# Altium schematic sheet AmpliRF.SchDoc
size A4
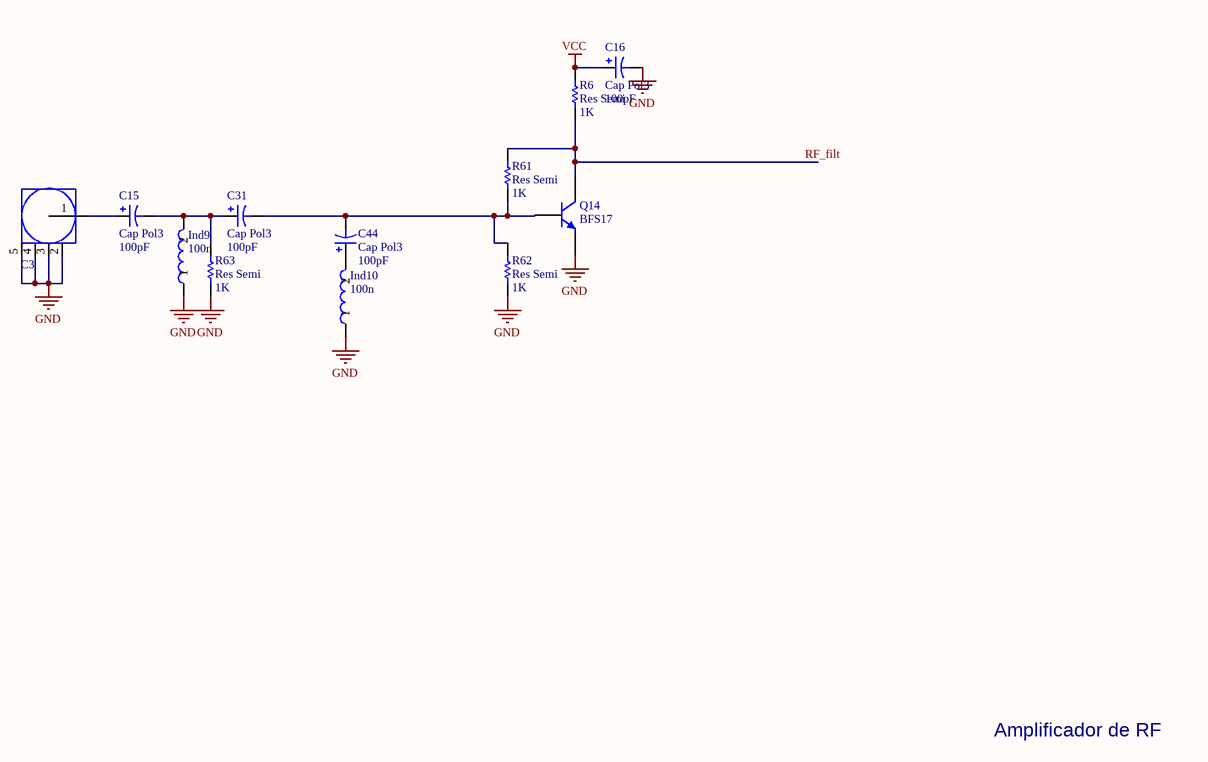
[diagram p0: AmpliRF.SchDoc]

## Parts
C3  SMA  [SMA1]  (value not drawn)
C15  Cap Pol3  value 100pF  [C0805]
C16  Cap Pol3  value 100pF  [C0805]
C31  Cap Pol3  value 100pF  [C0805]
C44  Cap Pol3  value 100pF  [C0805]
Ind9  Valor: 100n  [Ind_4mm]  (hidden comment: Ind2)
Ind10  Valor: 100n  [Ind_4mm]  (hidden comment: Ind2)
Q14  BFS17  [SOT-23]
R6  Res Semi  value 1K  [2012[0805]]
R61  Res Semi  value 1K  [2012[0805]]
R62  Res Semi  value 1K  [2012[0805]]
R63  Res Semi  value 1K  [2012[0805]]

## Nets
GND: C3.2(GND) C3.3(GND) C3.4(GND) C3.5(GND) C16.2 Ind9.1 Ind10.1 Q14.2(E) R62.2 R63.2
VCC: C16.1 R6.1
RF_filt: Q14.3(C) R6.2 R61.1
NetC3_1: C3.1(RF) C15.1
NetC15_2: C15.2 C31.1 Ind9.2 R63.1
NetC31_2: C31.2 C44.2 Q14.1(B) R61.2 R62.1
NetC44_1: C44.1 Ind10.2

## Notes on the sheet
- Amplificador de RF

## Library data of the parts
C15 C16 C31 C44 = Cap Pol3: Polarized Capacitor (Surface Mount); Published: 8-Jun-2000; LatestRevisionDate: 17-Jul-2002; LatestRevisionNote: Re-released for DXP Platform.; PackageReference: C0805; Publisher: Altium Limited
Q14 = BFS17: NPN 1 GHz Wideband Transistor; Published: 17-Sep-2003; LatestRevisionDate: 12-Dec-2006; LatestRevisionNote: IPC-7351 Footprint Added.; DatasheetVersion: Sep-1995; PackageVersion: May-1999; PackageReference: SOT23; Publisher: Altium Limited; PackageDescription: 3-Pin SOT-23 Package 0.95 mm Pitch, 2.3 mm Lead Span; ComponentLink1Description: Manufacturer Link; ComponentLink1URL: http://www.semiconductors.philips.com/; ComponentLink2Description: Datasheet; ComponentLink2URL: http://www.semiconductors.philips.com/acrobat/datasheets/BFS17_2.pdf
R6 R61-R63 = Res Semi: Semiconductor Resistor; Published: 8-Jun-2000; LatestRevisionDate: 17-Jul-2002; LatestRevisionNote: Re-released for DXP Platform.; PackageReference: AXIAL-0.5; Publisher: Altium Limited